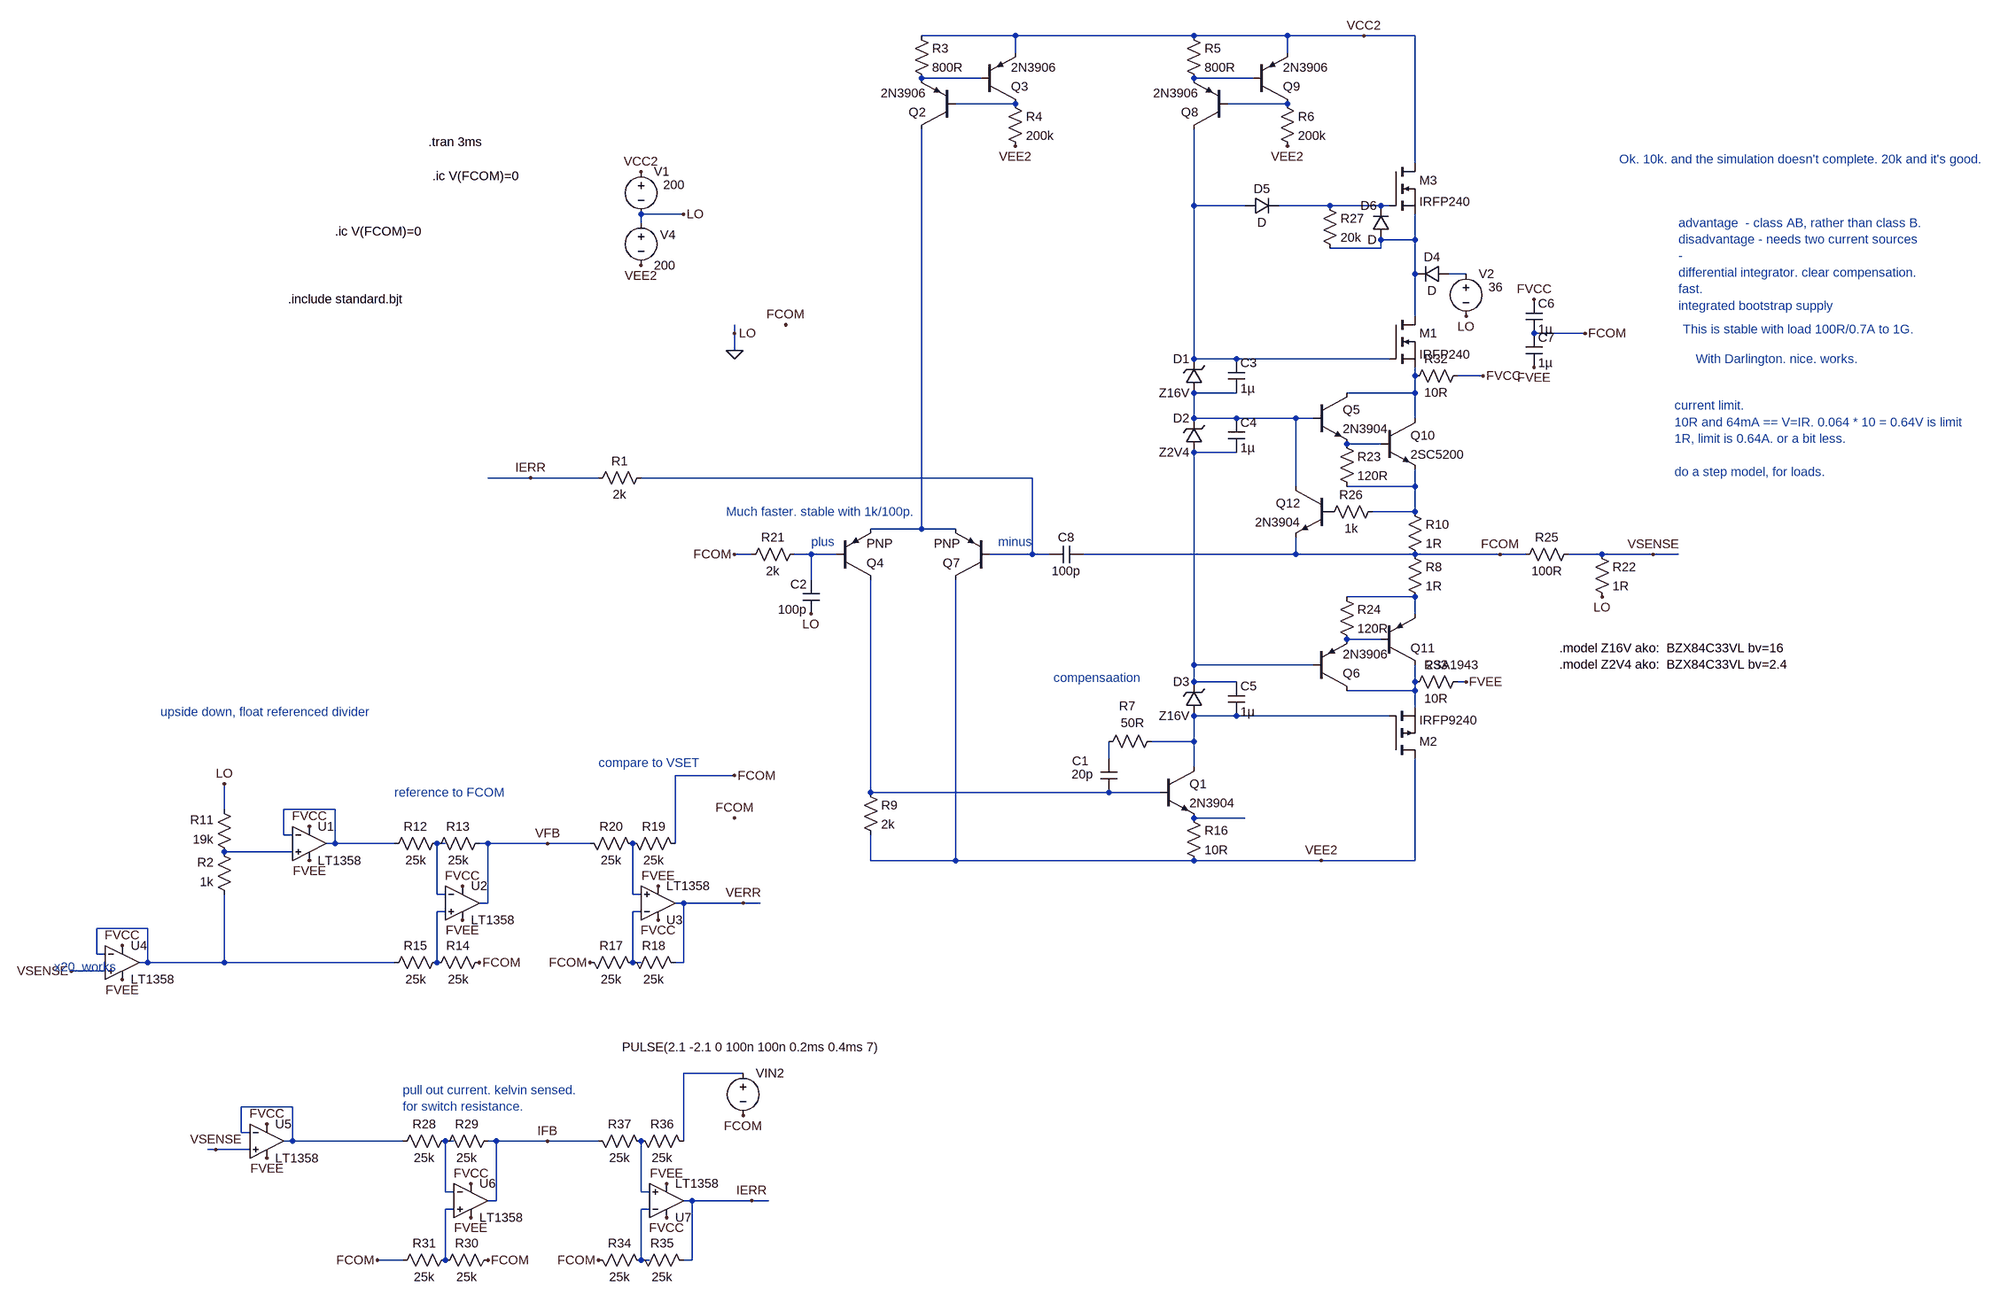
[diagram p0: schematic Draft55.asc]
Draft55.asc, the LTspice schematic file:
Version 4
SHEET 1 2756 1912
WIRE 368 -624 192 -624
WIRE 704 -624 368 -624
WIRE 880 -624 704 -624
WIRE 1024 -624 880 -624
WIRE 1120 -624 1024 -624
WIRE 368 -592 368 -624
WIRE 880 -592 880 -624
WIRE 304 -544 192 -544
WIRE 816 -544 704 -544
WIRE 368 -496 256 -496
WIRE 880 -496 768 -496
WIRE 1120 -384 1120 -624
WIRE 704 -304 704 -448
WIRE 800 -304 704 -304
WIRE 960 -304 864 -304
WIRE 1056 -304 960 -304
WIRE 1072 -304 1056 -304
WIRE -256 -288 -336 -288
WIRE -336 -272 -336 -288
WIRE 1120 -240 1120 -288
WIRE 1120 -240 1056 -240
WIRE 1056 -224 1056 -240
WIRE 1056 -224 960 -224
WIRE 1120 -176 1120 -240
WIRE 1216 -176 1184 -176
WIRE 1120 -96 1120 -176
WIRE -160 -64 -160 -80
WIRE 1440 -64 1344 -64
WIRE -160 -32 -160 -64
WIRE 704 -16 704 -304
WIRE 784 -16 704 -16
WIRE 1072 -16 784 -16
WIRE 1120 16 1120 0
WIRE 1248 16 1200 16
WIRE 784 48 704 48
WIRE 1120 48 1120 16
WIRE 1120 48 992 48
WIRE 704 96 704 48
WIRE 784 96 704 96
WIRE 896 96 784 96
WIRE 928 96 896 96
WIRE 1120 96 1120 48
WIRE 1056 144 992 144
WIRE 784 160 704 160
WIRE -544 208 -624 208
WIRE -416 208 -544 208
WIRE 400 208 -336 208
WIRE 896 224 896 96
WIRE 1120 224 1120 192
WIRE 1120 224 992 224
WIRE 1120 272 1120 224
WIRE 1120 272 1040 272
WIRE 192 304 192 -448
WIRE 192 304 96 304
WIRE 256 304 192 304
WIRE -128 352 -160 352
WIRE -16 352 -48 352
WIRE 32 352 -16 352
WIRE 400 352 400 208
WIRE 400 352 320 352
WIRE 432 352 400 352
WIRE 896 352 896 320
WIRE 896 352 496 352
WIRE 1120 352 896 352
WIRE 1280 352 1120 352
WIRE 1328 352 1280 352
WIRE 1472 352 1408 352
WIRE 1568 352 1472 352
WIRE 1616 352 1568 352
WIRE -16 400 -16 352
WIRE 1120 432 992 432
WIRE 1120 464 1120 432
WIRE 1056 512 992 512
WIRE 704 560 704 160
WIRE 928 560 704 560
WIRE 704 592 704 560
WIRE 784 592 704 592
WIRE 1120 592 1120 560
WIRE 1216 592 1200 592
WIRE 1120 608 1120 592
WIRE 1120 608 992 608
WIRE 1120 640 1120 608
WIRE 784 656 704 656
WIRE 1072 656 784 656
WIRE 704 704 704 656
WIRE 704 704 624 704
WIRE 544 736 544 704
WIRE 704 752 704 704
WIRE -160 768 -272 768
WIRE 96 800 96 400
WIRE 544 800 96 800
WIRE 640 800 544 800
WIRE -1120 832 -1120 784
WIRE -912 832 -1008 832
WIRE 800 848 704 848
WIRE -1008 880 -1008 832
WIRE -992 880 -1008 880
WIRE -912 896 -912 832
WIRE -912 896 -928 896
WIRE -800 896 -912 896
WIRE -704 896 -720 896
WIRE -624 896 -640 896
WIRE -512 896 -624 896
WIRE -432 896 -512 896
WIRE -272 896 -272 768
WIRE -992 912 -1120 912
WIRE 96 928 96 880
WIRE 256 928 256 400
WIRE 256 928 96 928
WIRE 704 928 256 928
WIRE 944 928 704 928
WIRE 1120 928 1120 736
WIRE 1120 928 944 928
WIRE -720 992 -720 896
WIRE -704 992 -720 992
WIRE -352 992 -352 896
WIRE -336 992 -352 992
WIRE -624 1008 -624 896
WIRE -624 1008 -640 1008
WIRE -256 1008 -272 1008
WIRE -144 1008 -256 1008
WIRE -112 1008 -144 1008
WIRE -704 1024 -720 1024
WIRE -336 1024 -352 1024
WIRE -1264 1056 -1360 1056
WIRE -1360 1104 -1360 1056
WIRE -1344 1104 -1360 1104
WIRE -1264 1120 -1264 1056
WIRE -1264 1120 -1280 1120
WIRE -1120 1120 -1120 992
WIRE -1120 1120 -1264 1120
WIRE -800 1120 -1120 1120
WIRE -720 1120 -720 1024
WIRE -352 1120 -352 1024
WIRE -336 1120 -352 1120
WIRE -256 1120 -256 1008
WIRE -256 1120 -272 1120
WIRE -1344 1136 -1408 1136
WIRE -144 1328 -256 1328
WIRE -992 1392 -1088 1392
WIRE -1088 1440 -1088 1392
WIRE -1072 1440 -1088 1440
WIRE -992 1456 -992 1392
WIRE -992 1456 -1008 1456
WIRE -784 1456 -992 1456
WIRE -688 1456 -704 1456
WIRE -608 1456 -624 1456
WIRE -512 1456 -608 1456
WIRE -416 1456 -512 1456
WIRE -256 1456 -256 1328
WIRE -1136 1472 -1152 1472
WIRE -1072 1472 -1136 1472
WIRE -704 1552 -704 1456
WIRE -688 1552 -704 1552
WIRE -336 1552 -336 1456
WIRE -320 1552 -336 1552
WIRE -608 1568 -608 1456
WIRE -608 1568 -624 1568
WIRE -240 1568 -256 1568
WIRE -128 1568 -240 1568
WIRE -96 1568 -128 1568
WIRE -688 1584 -704 1584
WIRE -320 1584 -336 1584
WIRE -784 1680 -832 1680
WIRE -704 1680 -704 1584
WIRE -336 1680 -336 1584
WIRE -320 1680 -336 1680
WIRE -240 1680 -240 1568
WIRE -240 1680 -256 1680
FLAG -160 -32 0
FLAG -336 -368 VCC2
FLAG -336 -192 VEE2
FLAG 944 928 VEE2
FLAG 368 -416 VEE2
FLAG 1024 -624 VCC2
FLAG 880 -416 VEE2
FLAG 1280 352 FCOM
FLAG 1440 -64 FCOM
FLAG -160 352 FCOM
FLAG -960 864 FVCC
FLAG -960 928 FVEE
FLAG -672 976 FVCC
FLAG -672 1040 FVEE
FLAG -832 1680 FCOM
FLAG -144 1008 VERR
FLAG -160 848 FCOM
FLAG -1408 1136 VSENSE
FLAG -1120 784 LO
FLAG -304 1040 FVCC
FLAG -304 976 FVEE
FLAG -432 1120 FCOM
FLAG -1312 1088 FVCC
FLAG -1312 1152 FVEE
FLAG 1568 352 VSENSE
FLAG -256 -288 LO
FLAG -160 -64 LO
FLAG -544 208 IERR
FLAG 1344 -128 FVCC
FLAG 1248 16 FVCC
FLAG 1344 0 FVEE
FLAG 1216 592 FVEE
FLAG -16 464 LO
FLAG 1472 432 LO
FLAG 1216 -96 LO
FLAG -1040 1424 FVCC
FLAG -1040 1488 FVEE
FLAG -656 1536 FVCC
FLAG -656 1600 FVEE
FLAG -624 1680 FCOM
FLAG -1136 1472 VSENSE
FLAG -512 1456 IFB
FLAG -64 -80 FCOM
FLAG -512 896 VFB
FLAG -640 1120 FCOM
FLAG -128 1568 IERR
FLAG -144 1408 FCOM
FLAG -288 1600 FVCC
FLAG -288 1536 FVEE
FLAG -416 1680 FCOM
FLAG -160 768 FCOM
SYMBOL voltage -336 -384 R0
WINDOW 123 0 0 Left 0
WINDOW 39 0 0 Left 0
WINDOW 3 42 41 Left 2
SYMATTR Value 200
SYMATTR InstName V1
SYMBOL voltage -336 -288 R0
WINDOW 123 0 0 Left 0
WINDOW 39 0 0 Left 0
WINDOW 0 36 39 Left 2
SYMATTR InstName V4
SYMATTR Value 200
SYMBOL npn 928 48 R0
SYMATTR InstName Q5
SYMATTR Value 2N3904
SYMBOL pnp 928 608 M180
SYMATTR InstName Q6
SYMATTR Value 2N3906
SYMBOL res 80 784 R0
SYMATTR InstName R9
SYMATTR Value 2k
SYMBOL res 688 832 R0
SYMATTR InstName R16
SYMATTR Value 10R
SYMBOL pnp 32 400 M180
SYMATTR InstName Q4
SYMBOL pnp 320 400 R180
SYMATTR InstName Q7
SYMBOL cap 768 96 R0
SYMATTR InstName C4
SYMATTR Value 1µ
SYMBOL zener 720 160 R180
WINDOW 0 24 64 Left 2
WINDOW 3 24 0 Left 2
SYMATTR InstName D2
SYMATTR Value Z2V4
SYMBOL npn 640 752 R0
SYMATTR InstName Q1
SYMATTR Value 2N3904
SYMBOL pnp 256 -448 R180
SYMATTR InstName Q2
SYMATTR Value 2N3906
SYMBOL pnp 304 -496 M180
SYMATTR InstName Q3
SYMATTR Value 2N3906
SYMBOL res 176 -640 R0
SYMATTR InstName R3
SYMATTR Value 800R
SYMBOL res 352 -512 R0
SYMATTR InstName R4
SYMATTR Value 200k
SYMBOL pnp 768 -448 R180
SYMATTR InstName Q8
SYMATTR Value 2N3906
SYMBOL pnp 816 -496 M180
SYMATTR InstName Q9
SYMATTR Value 2N3906
SYMBOL res 688 -640 R0
SYMATTR InstName R5
SYMATTR Value 800R
SYMBOL res 864 -512 R0
SYMATTR InstName R6
SYMATTR Value 200k
SYMBOL res 640 688 R90
WINDOW 0 -35 61 VBottom 2
WINDOW 3 -34 51 VTop 2
SYMATTR InstName R7
SYMATTR Value 50R
SYMBOL cap 528 736 R0
WINDOW 0 -53 5 Left 2
WINDOW 3 -54 30 Left 2
SYMATTR InstName C1
SYMATTR Value 20p
SYMBOL res 1104 336 R0
SYMATTR InstName R8
SYMATTR Value 1R
SYMBOL res 1104 256 R0
SYMATTR InstName R10
SYMATTR Value 1R
SYMBOL zener 720 48 R180
WINDOW 0 24 64 Left 2
WINDOW 3 24 0 Left 2
SYMATTR InstName D1
SYMATTR Value Z16V
SYMBOL cap 768 -16 R0
SYMATTR InstName C3
SYMATTR Value 1µ
SYMBOL nmos 1072 -96 R0
SYMATTR InstName M1
SYMATTR Value IRFP240
SYMBOL pmos 1072 736 M180
SYMATTR InstName M2
SYMATTR Value IRFP9240
SYMBOL cap 768 592 R0
SYMATTR InstName C5
SYMATTR Value 1µ
SYMBOL cap 1328 -128 R0
SYMATTR InstName C6
SYMATTR Value 1µ
SYMBOL cap 1328 -64 R0
SYMATTR InstName C7
SYMATTR Value 1µ
SYMBOL zener 720 656 R180
WINDOW 0 24 64 Left 2
WINDOW 3 24 0 Left 2
SYMATTR InstName D3
SYMATTR Value Z16V
SYMBOL res -320 192 R90
WINDOW 0 0 56 VBottom 2
WINDOW 3 32 56 VTop 2
SYMATTR InstName R1
SYMATTR Value 2k
SYMBOL cap 496 336 R90
WINDOW 0 0 32 VBottom 2
WINDOW 3 32 32 VTop 2
SYMATTR InstName C8
SYMATTR Value 100p
SYMBOL res -1104 1008 R180
WINDOW 0 36 76 Left 2
WINDOW 3 36 40 Left 2
SYMATTR InstName R2
SYMATTR Value 1k
SYMBOL res -1104 928 R180
WINDOW 0 36 76 Left 2
WINDOW 3 36 40 Left 2
SYMATTR InstName R11
SYMATTR Value 19k
SYMBOL res -704 880 R90
WINDOW 0 0 56 VBottom 2
WINDOW 3 32 56 VTop 2
SYMATTR InstName R12
SYMATTR Value 25k
SYMBOL res -624 880 R90
WINDOW 0 0 56 VBottom 2
WINDOW 3 32 56 VTop 2
SYMATTR InstName R13
SYMATTR Value 25k
SYMBOL res -624 1104 R90
WINDOW 0 0 56 VBottom 2
WINDOW 3 32 56 VTop 2
SYMATTR InstName R14
SYMATTR Value 25k
SYMBOL res -704 1104 R90
WINDOW 0 0 56 VBottom 2
WINDOW 3 32 56 VTop 2
SYMATTR InstName R15
SYMATTR Value 25k
SYMBOL OpAmps\\LT1358 -960 832 R0
SYMATTR InstName U1
SYMBOL OpAmps\\LT1358 -672 944 R0
SYMATTR InstName U2
SYMBOL res -336 1136 M270
WINDOW 0 32 56 VTop 2
WINDOW 3 0 56 VBottom 2
SYMATTR InstName R17
SYMATTR Value 25k
SYMBOL res -256 1136 M270
WINDOW 0 32 56 VTop 2
WINDOW 3 0 56 VBottom 2
SYMATTR InstName R18
SYMATTR Value 25k
SYMBOL res -256 912 M270
WINDOW 0 32 56 VTop 2
WINDOW 3 0 56 VBottom 2
SYMATTR InstName R19
SYMATTR Value 25k
SYMBOL res -336 912 M270
WINDOW 0 32 56 VTop 2
WINDOW 3 0 56 VBottom 2
SYMATTR InstName R20
SYMATTR Value 25k
SYMBOL OpAmps\\LT1358 -304 1072 M180
SYMATTR InstName U3
SYMBOL OpAmps\\LT1358 -1312 1056 R0
SYMATTR InstName U4
SYMBOL res -32 336 R90
WINDOW 0 0 56 VBottom 2
WINDOW 3 32 56 VTop 2
SYMATTR InstName R21
SYMATTR Value 2k
SYMBOL cap 0 464 R180
WINDOW 0 24 56 Left 2
WINDOW 3 24 8 Left 2
SYMATTR InstName C2
SYMATTR Value 100p
SYMBOL res 1456 336 R0
SYMATTR InstName R22
SYMATTR Value 1R
SYMBOL npn 1056 96 R0
SYMATTR InstName Q10
SYMATTR Value 2SC5200
SYMBOL pnp 1056 560 M180
WINDOW 3 85 0 Left 2
SYMATTR Value 2SA1943
SYMATTR InstName Q11
SYMBOL res 976 128 R0
SYMATTR InstName R23
SYMATTR Value 120R
SYMBOL res 976 416 R0
SYMATTR InstName R24
SYMATTR Value 120R
SYMBOL res 1424 336 R90
WINDOW 0 0 56 VBottom 2
WINDOW 3 32 56 VTop 2
SYMATTR InstName R25
SYMATTR Value 100R
SYMBOL npn 960 224 M0
SYMATTR InstName Q12
SYMATTR Value 2N3904
SYMBOL res 1056 256 R90
WINDOW 0 0 56 VBottom 2
WINDOW 3 32 56 VTop 2
SYMATTR InstName R26
SYMATTR Value 1k
SYMBOL diode 1184 -192 R90
WINDOW 0 0 32 VBottom 2
WINDOW 3 32 32 VTop 2
SYMATTR InstName D4
SYMBOL voltage 1216 -192 R0
WINDOW 123 0 0 Left 0
WINDOW 39 0 0 Left 0
WINDOW 3 42 41 Left 2
SYMATTR Value 36
SYMATTR InstName V2
SYMBOL nmos 1072 -384 R0
SYMATTR InstName M3
SYMATTR Value IRFP240
SYMBOL diode 800 -288 R270
WINDOW 0 32 32 VTop 2
WINDOW 3 0 32 VBottom 2
SYMATTR InstName D5
SYMBOL diode 1072 -240 R180
WINDOW 0 24 64 Left 2
WINDOW 3 24 0 Left 2
SYMATTR InstName D6
SYMBOL res 944 -320 R0
SYMATTR InstName R27
SYMATTR Value 20k
SYMBOL res -688 1440 R90
WINDOW 0 0 56 VBottom 2
WINDOW 3 32 56 VTop 2
SYMATTR InstName R28
SYMATTR Value 25k
SYMBOL res -608 1440 R90
WINDOW 0 0 56 VBottom 2
WINDOW 3 32 56 VTop 2
SYMATTR InstName R29
SYMATTR Value 25k
SYMBOL res -608 1664 R90
WINDOW 0 0 56 VBottom 2
WINDOW 3 32 56 VTop 2
SYMATTR InstName R30
SYMATTR Value 25k
SYMBOL res -688 1664 R90
WINDOW 0 0 56 VBottom 2
WINDOW 3 32 56 VTop 2
SYMATTR InstName R31
SYMATTR Value 25k
SYMBOL OpAmps\\LT1358 -1040 1392 R0
SYMATTR InstName U5
SYMBOL OpAmps\\LT1358 -656 1504 R0
SYMATTR InstName U6
SYMBOL res 1216 0 R90
WINDOW 0 0 56 VBottom 2
WINDOW 3 32 56 VTop 2
SYMATTR InstName R32
SYMATTR Value 10R
SYMBOL res 1216 576 R90
WINDOW 0 0 56 VBottom 2
WINDOW 3 32 56 VTop 2
SYMATTR InstName R33
SYMATTR Value 10R
SYMBOL voltage -144 1312 R0
WINDOW 123 0 0 Left 0
WINDOW 39 0 0 Left 0
WINDOW 3 -228 -33 Left 2
SYMATTR Value PULSE(2.1 -2.1 0 100n 100n 0.2ms 0.4ms 7)
SYMATTR InstName VIN2
SYMBOL res -320 1696 M270
WINDOW 0 32 56 VTop 2
WINDOW 3 0 56 VBottom 2
SYMATTR InstName R34
SYMATTR Value 25k
SYMBOL res -240 1696 M270
WINDOW 0 32 56 VTop 2
WINDOW 3 0 56 VBottom 2
SYMATTR InstName R35
SYMATTR Value 25k
SYMBOL res -240 1472 M270
WINDOW 0 32 56 VTop 2
WINDOW 3 0 56 VBottom 2
SYMATTR InstName R36
SYMATTR Value 25k
SYMBOL res -320 1472 M270
WINDOW 0 32 56 VTop 2
WINDOW 3 0 56 VBottom 2
SYMATTR InstName R37
SYMATTR Value 25k
SYMBOL OpAmps\\LT1358 -288 1632 M180
SYMATTR InstName U7
TEXT -736 -424 Left 2 !.tran 3ms
TEXT 336 328 Left 2 ;minus
TEXT -16 328 Left 2 ;plus
TEXT -176 272 Left 2 ;Much faster. stable with 1k/100p.
TEXT 440 584 Left 2 ;compensaation
TEXT -728 -360 Left 2 !.ic V(FCOM)=0
TEXT -1440 1128 Left 2 ;x20. works
TEXT 1392 528 Left 2 !.model Z16V ako:  BZX84C33VL bv=16\n.model Z2V4 ako:  BZX84C33VL bv=2.4
TEXT -1000 -128 Left 2 !.include standard.bjt
TEXT 1648 -16 Left 2 ;With Darlington. nice. works.
TEXT 1624 -72 Left 2 ;This is stable with load 100R/0.7A to 1G.
TEXT 1616 -272 Left 2 ;advantage  - class AB, rather than class B.\ndisadvantage - needs two current sources\n-\ndifferential integrator. clear compensation.\nfast.\nintegrated bootstrap supply
TEXT -800 800 Left 2 ;reference to FCOM
TEXT -416 744 Left 2 ;compare to VSET
TEXT -1240 648 Left 2 ;upside down, float referenced divider
TEXT 1608 72 Left 2 ;current limit. \n10R and 64mA == V=IR. 0.064 * 10 = 0.64V is limit\n1R, limit is 0.64A. or a bit less.\n \ndo a step model, for loads.
TEXT 1504 -392 Left 2 ;Ok. 10k. and the simulation doesn't complete. 20k and it's good.
TEXT -784 1360 Left 2 ;pull out current. kelvin sensed.\nfor switch resistance.
TEXT -912 -256 Left 2 !.ic V(FCOM)=0

The netlist it stands for:
* Draft55.asc
V1 VCC2 0 200
V4 0 VEE2 200
Q5 N009 N010 N011 0 2N3904
Q6 N019 N012 N018 0 2N3906
R9 N022 VEE2 2k
R16 N024 VEE2 10R
Q4 N022 N016 N015 0 PNP
Q7 VEE2 N013 N015 0 PNP
C4 N010 N012 1µ
D2 N012 N010 Z2V4
Q1 N020 N022 N024 0 2N3904
Q2 N015 N003 N001 0 2N3906
Q3 N003 N001 VCC2 0 2N3906
R3 VCC2 N001 800R
R4 N003 VEE2 200k
Q8 N005 N004 N002 0 2N3906
Q9 N004 N002 VCC2 0 2N3906
R5 VCC2 N002 800R
R6 N004 VEE2 200k
R7 N020 N021 50R
C1 N021 N022 20p
R8 FCOM N017 1R
R10 N014 FCOM 1R
D1 N010 N005 Z16V
C3 N005 N010 1µ
M1 N007 N005 N009 N009 IRFP240
M2 VEE2 N020 N019 N019 IRFP9240
C5 N012 N020 1µ
C6 FVCC FCOM 1µ
C7 FCOM FVEE 1µ
D3 N020 N012 Z16V
R1 N013 IERR 2k
C8 FCOM N013 100p
R2 N030 N026 1k
R11 N026 0 19k
R12 N025 N023 25k
R13 VFB N025 25k
R14 FCOM N028 25k
R15 N028 N030 25k
XU1 N026 N023 FVCC FVEE N023 LT1357  ; LT1358, pins In+ In- V+ V- OUT
XU2 N028 N025 FVCC FVEE VFB LT1357  ; LT1358, pins In+ In- V+ V- OUT
R17 N029 FCOM 25k
R18 VERR N029 25k
R19 FCOM N027 25k
R20 N027 VFB 25k
XU3 N027 N029 FVCC FVEE VERR LT1357  ; LT1358, pins In+ In- V+ V- OUT
XU4 VSENSE N030 FVCC FVEE N030 LT1357  ; LT1358, pins In+ In- V+ V- OUT
R21 N016 FCOM 2k
C2 0 N016 100p
R22 VSENSE 0 1R
Q10 N009 N011 N014 0 2SC5200
Q11 N019 N018 N017 0 2SA1943
R23 N011 N014 120R
R24 N017 N018 120R
R25 VSENSE FCOM 100R
Q12 N010 P001 FCOM 0 2N3904
R26 N014 P001 1k
D4 N008 N007 D
V2 N008 0 36
M3 VCC2 N006 N007 N007 IRFP240
D5 N005 N006 D
D6 N007 N006 D
R27 N006 N007 20k
R28 N033 N032 25k
R29 IFB N033 25k
R30 FCOM N035 25k
R31 N035 FCOM 25k
XU5 VSENSE N032 FVCC FVEE N032 LT1357  ; LT1358, pins In+ In- V+ V- OUT
XU6 N035 N033 FVCC FVEE IFB LT1357  ; LT1358, pins In+ In- V+ V- OUT
R32 FVCC N009 10R
R33 FVEE N019 10R
VIN2 N031 FCOM PULSE(2.1 -2.1 0 100n 100n 0.2ms 0.4ms 7)
R34 N036 FCOM 25k
R35 IERR N036 25k
R36 N031 N034 25k
R37 N034 IFB 25k
XU7 N034 N036 FVCC FVEE IERR LT1357  ; LT1358, pins In+ In- V+ V- OUT
.model D D
.lib standard.dio
.model NPN NPN
.model PNP PNP
.lib standard.bjt
.model NMOS NMOS
.model PMOS PMOS
.lib standard.mos
.tran 3ms
* minus
* plus
* Much faster. stable with 1k/100p.
* compensaation
.ic V(FCOM)=0
* x20. works
.model Z16V ako:  BZX84C33VL bv=16
.model Z2V4 ako:  BZX84C33VL bv=2.4
.include standard.bjt
* With Darlington. nice. works.
* This is stable with load 100R/0.7A to 1G.
* advantage  - class AB, rather than class B.
* disadvantage - needs two current sources
* -
* differential integrator. clear compensation.
* fast.
* integrated bootstrap supply
* reference to FCOM
* compare to VSET
* upside down, float referenced divider
* current limit.
* 10R and 64mA == V=IR. 0.064 * 10 = 0.64V is limit
* 1R, limit is 0.64A. or a bit less.
* do a step model, for loads.
* Ok. 10k. and the simulation doesn't complete. 20k and it's good.
* pull out current. kelvin sensed.
* for switch resistance.
.ic V(FCOM)=0
.lib LTC.lib
.backanno
.end